# Altium project NRV-BRK-OUT.PrjPCB
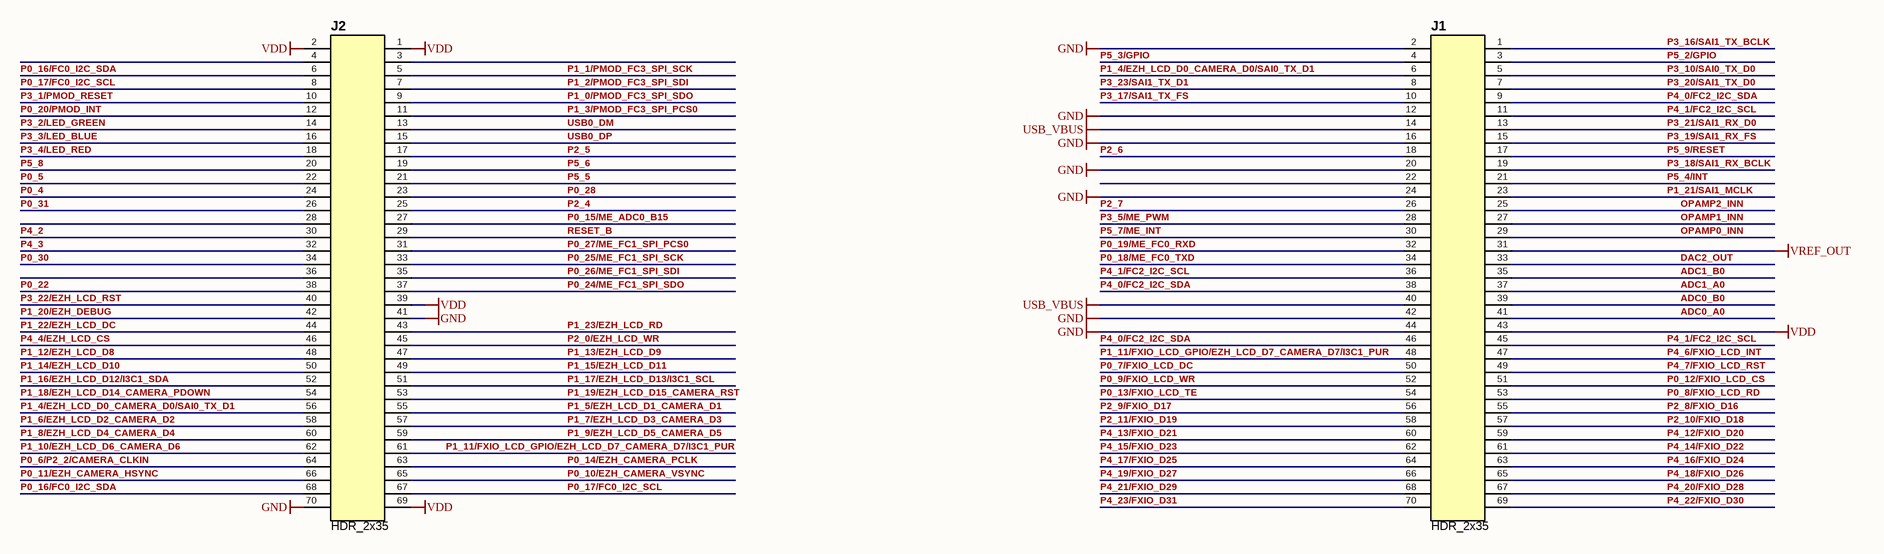
[diagram p0: NRV_BRK_OUT.SchDoc]
BOM_NOTES_LINE_1: -; BOM_NOTES_LINE_2: -; BOM_NOTES_LINE_3: -; BOM_NOTES_LINE_4: -; CCA_PART_NUMBER: BB0005; CCA_TITLE: Bullet Bill; PCB_COPPER_WEIGHT_INNER: 1oz; PCB_COPPER_WEIGHT_OUTER: 1oz; PCB_FINISH_PLATING: GOLD ENIG; PCB_FINISHED_THICKNESS: .032; PCB_LAYERS: 6; PCB_MATERIAL: FR4; PCB_MIN_DRILL: 10; PCB_MIN_TRACE_SPACE: 6; PCB_MIN_TRACE_WIDTH: 6; PCB_PART_NUMBER: BB0006; PCB_PRINTOUT_SCALE: 1:1; PCB_SILKSCREEN_COLOR_BOTTOM: none; PCB_SILKSCREEN_COLOR_TOP: BLACK; PCB_SOLDER_MASK_COLOR_BOTTOM: BLACK; PCB_TITLE: BULLET BILL BATT BREAKOUT; PCB_VERSION: B; PROJECT_ENGINEER: E. Hughes; PROJECT_SHORT_TITLE: BB_BAT; PROJECT_STATUS: PROTOTYPE; PROJECT_TITLE_LINE_1: Bullet Bill; SCH_DATE: 2022-08-10
1 sheet, 2 parts. Net scope: hierarchical (ports join the sheet entries above them; power ports are global).
Board file: NRV_BRK_OUT.PCBDOC

## Sheet NRV_BRK_OUT.SchDoc
size D

### Parts
J1  HDR_2x35  [HEADER 2x35 .100"]
J2  HDR_2x35  [HEADER 2x35 .100"]

### Nets
GND: J1.2 J1.12 J1.16 J1.20 J1.24 J1.42 J1.44 J2.41 J2.70
USB_VBUS: J1.14 J1.40
VDD: J1.43 J2.1 J2.2 J2.39 J2.69
VREF_OUT: J1.31
ADC0_A0: J1.41
ADC0_B0: J1.39
ADC1_A0: J1.37
ADC1_B0: J1.35
DAC2_OUT: J1.33
OPAMP0_INN: J1.29
OPAMP1_INN: J1.27
OPAMP2_INN: J1.25
P0_4: J2.24
P0_5: J2.22
P0_6/P2_2/CAMERA_CLKIN: J2.64
P0_7/FXIO_LCD_DC: J1.50
P0_8/FXIO_LCD_RD: J1.53
P0_9/FXIO_LCD_WR: J1.52
P0_10/EZH_CAMERA_VSYNC: J2.65
P0_11/EZH_CAMERA_HSYNC: J2.66
P0_12/FXIO_LCD_CS: J1.51
P0_13/FXIO_LCD_TE: J1.54
P0_14/EZH_CAMERA_PCLK: J2.63
P0_15/ME_ADC0_B15: J2.27
P0_16/FC0_I2C_SDA: J2.6 J2.68
P0_17/FC0_I2C_SCL: J2.8 J2.67
P0_18/ME_FC0_TXD: J1.34
P0_19/ME_FC0_RXD: J1.32
P0_20/PMOD_INT: J2.12
P0_22: J2.38
P0_24/ME_FC1_SPI_SDO: J2.37
P0_25/ME_FC1_SPI_SCK: J2.33
P0_26/ME_FC1_SPI_SDI: J2.35
P0_27/ME_FC1_SPI_PCS0: J2.31
P0_28: J2.23
P0_30: J2.34
P0_31: J2.26
P1_0/PMOD_FC3_SPI_SDO: J2.9
P1_1/PMOD_FC3_SPI_SCK: J2.5
P1_2/PMOD_FC3_SPI_SDI: J2.7
P1_3/PMOD_FC3_SPI_PCS0: J2.11
P1_4/EZH_LCD_D0_CAMERA_D0/SAI0_TX_D1: J1.6 J2.56
P1_5/EZH_LCD_D1_CAMERA_D1: J2.55
P1_6/EZH_LCD_D2_CAMERA_D2: J2.58
P1_7/EZH_LCD_D3_CAMERA_D3: J2.57
P1_8/EZH_LCD_D4_CAMERA_D4: J2.60
P1_9/EZH_LCD_D5_CAMERA_D5: J2.59
P1_10/EZH_LCD_D6_CAMERA_D6: J2.62
P1_11/FXIO_LCD_GPIO/EZH_LCD_D7_CAMERA_D7/I3C1_PUR: J1.48 J2.61
P1_12/EZH_LCD_D8: J2.48
P1_13/EZH_LCD_D9: J2.47
P1_14/EZH_LCD_D10: J2.50
P1_15/EZH_LCD_D11: J2.49
P1_16/EZH_LCD_D12/I3C1_SDA: J2.52
P1_17/EZH_LCD_D13/I3C1_SCL: J2.51
P1_18/EZH_LCD_D14_CAMERA_PDOWN: J2.54
P1_19/EZH_LCD_D15_CAMERA_RST: J2.53
P1_20/EZH_DEBUG: J2.42
P1_21/SAI1_MCLK: J1.23
P1_22/EZH_LCD_DC: J2.44
P1_23/EZH_LCD_RD: J2.43
P2_0/EZH_LCD_WR: J2.45
P2_4: J2.25
P2_5: J2.17
P2_6: J1.18
P2_7: J1.26
P2_8/FXIO_D16: J1.55
P2_9/FXIO_D17: J1.56
P2_10/FXIO_D18: J1.57
P2_11/FXIO_D19: J1.58
P3_1/PMOD_RESET: J2.10
P3_2/LED_GREEN: J2.14
P3_3/LED_BLUE: J2.16
P3_4/LED_RED: J2.18
P3_5/ME_PWM: J1.28
P3_10/SAI0_TX_D0: J1.5
P3_16/SAI1_TX_BCLK: J1.1
P3_17/SAI1_TX_FS: J1.10
P3_18/SAI1_RX_BCLK: J1.19
P3_19/SAI1_RX_FS: J1.15
P3_20/SAI1_TX_D0: J1.7
P3_21/SAI1_RX_D0: J1.13
P3_22/EZH_LCD_RST: J2.40
P3_23/SAI1_TX_D1: J1.8
P4_0/FC2_I2C_SDA: J1.9 J1.38 J1.46
P4_1/FC2_I2C_SCL: J1.11 J1.36 J1.45
P4_2: J2.30
P4_3: J2.32
P4_4/EZH_LCD_CS: J2.46
P4_6/FXIO_LCD_INT: J1.47
P4_7/FXIO_LCD_RST: J1.49
P4_12/FXIO_D20: J1.59
P4_13/FXIO_D21: J1.60
P4_14/FXIO_D22: J1.61
P4_15/FXIO_D23: J1.62
P4_16/FXIO_D24: J1.63
P4_17/FXIO_D25: J1.64
P4_18/FXIO_D26: J1.65
P4_19/FXIO_D27: J1.66
P4_20/FXIO_D28: J1.67
P4_21/FXIO_D29: J1.68
P4_22/FXIO_D30: J1.69
P4_23/FXIO_D31: J1.70
P5_2/GPIO: J1.3
P5_3/GPIO: J1.4
P5_4/INT: J1.21
P5_5: J2.21
P5_6: J2.19
P5_7/ME_INT: J1.30
P5_8: J2.20
P5_9/RESET: J1.17
RESET_B: J2.29
USB0_DM: J2.13
USB0_DP: J2.15

Not connected (* = marked no-connect by the designer): J1 22; J2 3 4 28 36

### Notes on the sheet
- PCB REV
- CCA REV
- Sheet
- of

### Library data of the parts
J1 J2 = HDR_2x35: 2x35 Header .100"; Value: HDR_2x35; Supplier 1: Digi-Key; Supplier Part Number 1: 1849-PR20204VBDN-ND; RoHS: No; Stock: 3387; Pricing: 1=0.16000, 10=0.15400, 100=0.09510, 500=0.07872, 1000=0.06888, 5000=0.05904, 10000=0.05740 (USD)

## Assembly variants
C: all parts fitted